# Altium schematic sheet JacdacKeycapButtonBc30 135.SchDoc: Complete design
size A4; DocumentNumber: 1; SheetNumber: 1; SheetTotal: 1; VersionControl_RevNumber: 1
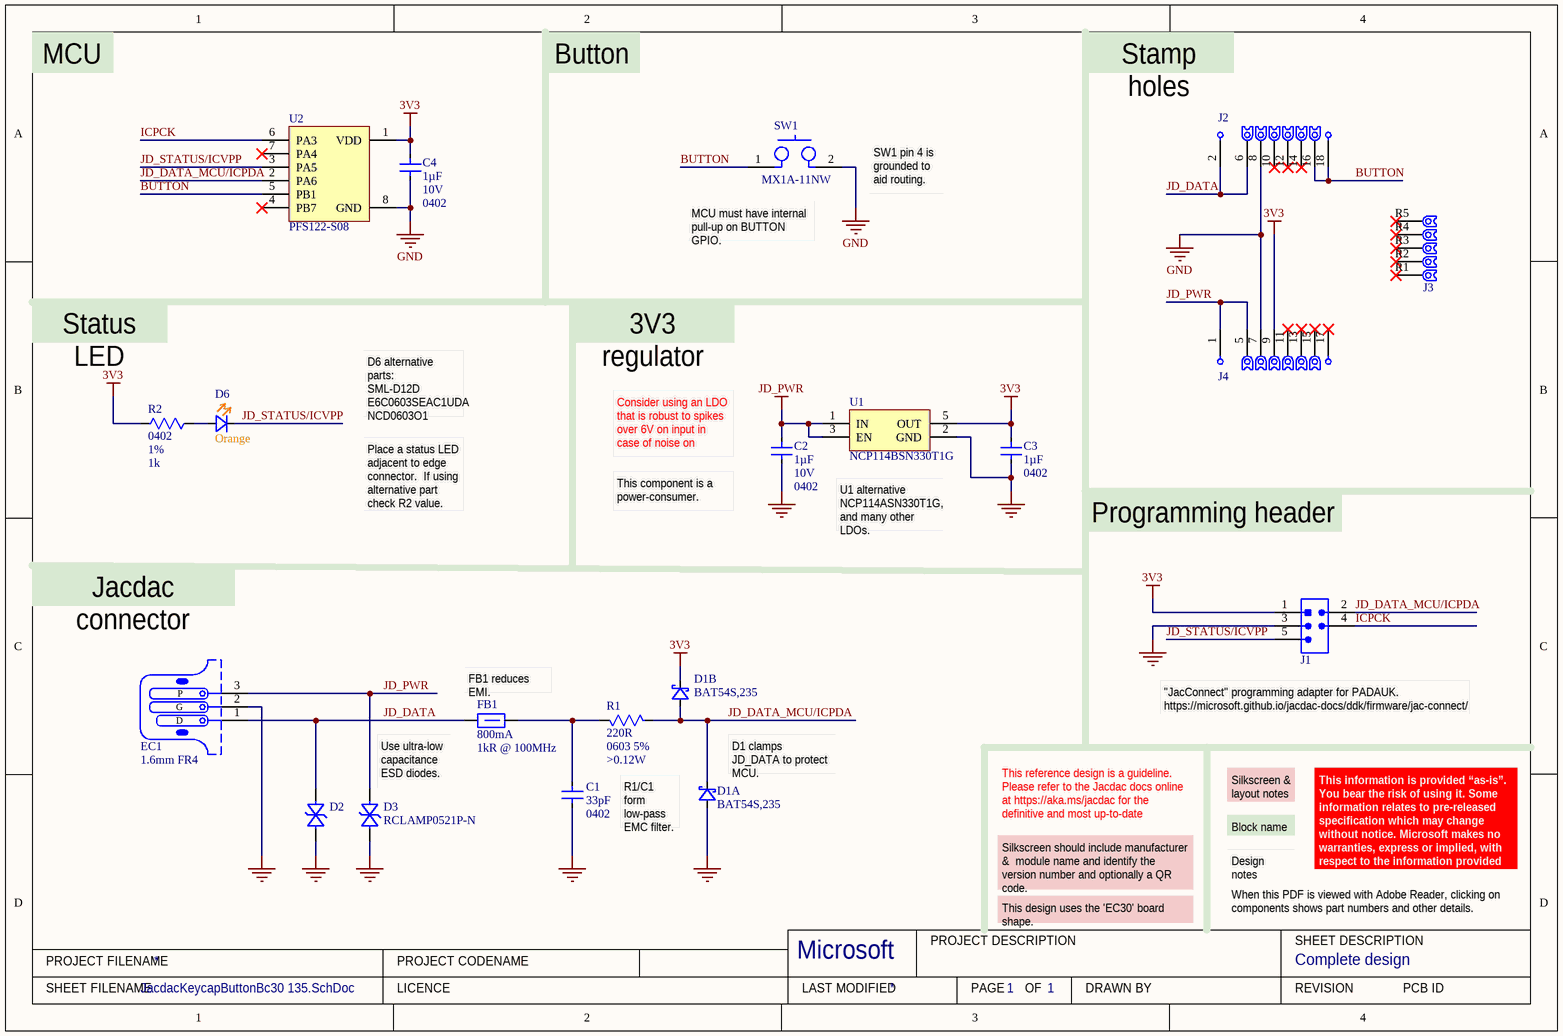
[diagram p0: JacdacKeycapButtonBc30 135.SchDoc]

## Parts
C1  Case Code (Imperial): 0402  Capacitance: 33pF  [C0402_0.55MM - without outline]  (hidden comment: CL05C330JB5NNNC)
C2  Capacitance: 1µF  Voltage Rating: 10V  Case Code (Imperial): 0402  [C0402_0.55MM - without outline]  (hidden comment: CL05A105KP5NNNC)
C3  Capacitance: 1µF  Case Code (Imperial): 0402  [C0402_0.55MM - without outline]  (hidden comment: CL05A105KP5NNNC)
C4  Capacitance: 1µF  Voltage Rating: 10V  Case Code (Imperial): 0402  [C0402_0.55MM - without outline]  (hidden comment: CL05A105KP5NNNC)
D1  Manufacturer Part Number: BAT54S,235  [NXP-BAT54S-TO-236AB - without outline]  (hidden comment: BAT54S)  (parts A,B of 2)
D2  RCLAMP0521P-N  [TVS 0402 - XL]  (value not drawn)
D3  RCLAMP0521P-N  [TVS 0402 - XL]
D6  Colour: Orange  [0603 Orange - without outline]  (hidden comment: 19-217/S2C-AQ1R1B/3T)
EC1  PCB Type: 1.6mm FR4  [JACDAC_EDGE_CONNECTOR_NO_TRACES_3D_PADS]  (hidden comment: 3 pin JACDAC edge connector)  (no BOM)
FB1  Current Rating: 800mA  Impedance: 1kR @ 100MHz  [TDK MPZ1608 0.8mm - without outline]  (hidden comment: TDK MPZ1608S102ATA00)
J1  Hack Connect Mini 1.27 mm pitch 2-row  [HACK_CONNECT_MINI_5_X_1_27_0.559mm_TH]  (value not drawn)  (no BOM)
J2  0.1"  [Jacdac BC30 stamp holes 20mm top x8]  (value not drawn)  (no BOM)
J3  BC30 stamp holes  [Jacdac BC30 stamp holes 10mm right x5]  (value not drawn)  (no BOM)
J4  0.1"  [Jacdac BC30 stamp holes 20mm bottom x8]  (value not drawn)  (no BOM)
R1  Case/Package: 0603  Comment 1: 5%  Comment 2: >0.12W  [RC0603]  (hidden comment: 220R)
R2  Case Code (Imperial): 0402  Tolerance: 1%  Resistance: 1k  [R0402 - Without outline]  (hidden comment: RC0402FR-071KL)
SW1  Mechanical keyboard mount  [MX1A-11NW]  (value not drawn)
U1  LDO 3.3V/300 mA  [ON_SEMI-SOT23-5 - without outline]  (value not drawn)
U2  PFS122-S08  [SOP-8]

## Nets
3V3: C3.2 C4.2 D1.2(K) J1.1(VCC) J4.9 R2.2 U1.5(OUT) U2.1(VDD)
GND: C1.1 C2.1 C3.1 C4.1 D1.1(A) D2.2(A) D3.2(A) EC1.2(G) J1.3(GND) J2.8 J4.7 SW1.2(B) U1.2(GND) U2.8(GND)
JD_PWR: C2.2 D3.1(K) EC1.3(P) J4.1 J4.5 U1.1(IN) U1.3(EN)
BUTTON: J2.16 J2.18 SW1.1(A) U2.5(PB1)
ICPCK: J1.4(SWCLK) U2.6(PA3)
JD_DATA: D2.1(K) EC1.1(D) FB1.1 J2.2 J2.6
JD_DATA_MCU/ICPDA: D1.3(K) J1.2(SWDIO) R1.1 U2.2(PA6)
JD_STATUS/ICVPP: D6.1(K) J1.5(RESET) U2.3(PA5)
NetC1_2: C1.2 FB1.2 R1.2
NetD6_2: D6.2(A) R2.1

Not connected (* = marked no-connect by the designer): J2 10* 12* 14*; J3 R1* R2* R3* R4* R5*; J4 11* 13* 15* 17*; U2 4(PB7)* 7(PA4)*

## Notes on the sheet
- MCU
- Button
- Stamp holes
- (near SW1) MCU must have internal pull-up on BUTTON GPIO.
- SW1 pin 4 is grounded to aid routing.
- Status LED
- 3V3 regulator
- D6 alternative parts:
  SML-D12D
  E6C0603SEAC1UDA
  NCD0603O1
- Place a status LED adjacent to edge connector.  If using alternative part check R2 value.
- (near C2) Consider using an LDO that is robust to spikes over 6V on input in case of noise on JD_PWR.
- (near C2) This component is a power-consumer.
- U1 alternative
  NCP114ASN330T1G, and many other LDOs.
- Programming header
- Jacdac connector
- (near FB1) FB1 reduces EMI.
- (near J1) "JacConnect" programming adapter for PADAUK.
  https://microsoft.github.io/jacdac-docs/ddk/firmware/jac-connect/
- (near D3) Use ultra-low capacitance ESD diodes.
- (near D1) D1 clamps JD_DATA to protect MCU.
- (near D1) R1/C1 form low-pass EMC filter.
- This reference design is a guideline. Please refer to the Jacdac docs online at https://aka.ms/jacdac for the definitive and most up-to-date information.
- Block name
- Silkscreen & layout notes
- This design uses the 'EC30' board shape.
- Silkscreen should include manufacturer &  module name and identify the version number and optionally a QR code.
- Design notes
- When this PDF is viewed with Adobe Reader, clicking on components shows part numbers and other details.
- This information is provided “as-is”. You bear the risk of using it. Some information relates to pre-released specification which may change without notice. Microsoft makes no warranties, express or implied, with respect to the information provided here.
- PROJECT FILENAME
- PROJECT CODENAME
- Microsoft
- PROJECT DESCRIPTION
- SHEET DESCRIPTION
- SHEET FILENAME
- LICENCE
- LAST MODIFIED
- PAGE
- OF
- DRAWN BY
- REVISION
- PCB ID

## Library data of the parts
C1 = CL05C330JB5NNNC: CAP CER 33PF 50V C0G/NP0 0402; Manufacturer: Samsung; Material: Ceramic; Tolerance: 5%; Dielectric: C0G; Temperature Coefficient: 300ppm/°C; Supplier 1: Digi-Key; Manufacturer Part Number: CL05C330JB5NNNC; RoHS: Yes; Category: Ceramic Capacitors; Stock 1: 5436088; Pricing 1: 1=0.10000, 10=0.02300, 50=0.01260, 100=0.01040, 500=0.00740, 1000=0.00582, 2500=0.00529, 5000=0.00487 (USD); Mount: Surface Mount; Case Code (Metric): 1005; Contact Plating: Tin; Min Operating Temperature: -55°C; Max Operating Temperature: 125°C; Package Quantity: 1; Packaging: Tape and Reel; Voltage: 50V; Voltage Rating (DC): 50V; Series: CL; Construction: Flat; Length: 1mm; Width: 0.02inch; Height: 0.5mm; Thickness: 0.022inch; Depth: 0.5mm; Radiation Hardening: No; Lead Free: Lead Free; RoHS Compliant: Yes; ComponentLink1URL: https://datasheet.ciiva.com/15195/getdatasheetpartid-355282-15195687.pdf; ComponentLink1Description: Online datasheet; Supplier 2: Newark; Stock 2: 45340; Pricing 2: 1=0.12500, 25=0.02900, 100=0.01300, 250=0.01100, 500=0.00900, 1000=0.00600 (USD); Supplier 3: Mouser; Stock 3: 8877; Pricing 3: 1=0.10000, 10=0.01400, 50=0.01400, 100=0.01100, 1000=0.00600, 10000=0.00400 (USD); Supplier 4: Farnell; Stock 4: 10934; Pricing 4: 150=0.01120, 500=0.00860, 2500=0.00640, 5000=0.00550 (GBP); Supplier Part Number 4: 3013373RL; Supplier Part Number 3: 187-CL05C330JB5NNNC; Supplier Part Number 2: 82AC9259; Supplier Part Number 1: 1276-1272-1-ND; Voltage Rating: 50V; Case/Package: 0402
C2-C4 = CL05A105KP5NNNC: CAP CER 1UF 10V X5R 0402; Manufacturer: Samsung; Material: Ceramic; Tolerance: 10%; Supplier 1: Digi-Key; Manufacturer Part Number: CL05A105KP5NNNC; RoHS: Yes; Category: Capacitors; Stock 1: 5705569; Pricing 1: 1=0.10000, 10=0.03900, 50=0.02100, 100=0.01720, 500=0.01228, 1000=0.00965, 2500=0.00877, 5000=0.00807 (USD); Mount: Surface Mount; Case/Package: 0402; Case Code (Metric): 1005; Contact Plating: Tin; Min Operating Temperature: -55°C; Max Operating Temperature: 85°C; Dielectric: X5R; Package Quantity: 1; Packaging: Tape and Reel; Length: 1mm; Height: 0.5mm; Width: 0.02inch; Thickness: 0.022inch; Depth: 0.5mm; Radiation Hardening: No; ComponentLink1URL: https://datasheet.ciiva.com/15195/getdatasheetpartid-358390-15195630.pdf; ComponentLink1Description: Online datasheet; Supplier 2: Mouser; Stock 2: 928941; Pricing 2: 1=0.10000, 10=0.04200, 100=0.01800, 500=0.01300, 1000=0.01000, 2500=0.00900 (USD); Supplier 3: Farnell; Stock 3: 53670; Pricing 3: 10=0.02450, 100=0.02000, 500=0.01310, 2500=0.00920, 5000=0.00810, 10000=0.00640, 50000=0.00490 (GBP); Supplier Part Number 3: 3013329; Supplier Part Number 2: 187-CL05A105KP5NNNC; Supplier Part Number 1: 1276-1076-1-ND; Created: DG; Checked: ?
  C3: Voltage Rating: 10V
D1 = BAT54S: DIODE ARRAY SCHOTTKY 30V SOT23; Manufacturer: Nexperia; Supplier 1: Digi-Key; RoHS: No; Category: Rectifier Diodes; Stock 1: 14011; Pricing 1: 1=0.13000, 10=0.11900, 100=0.05610, 500=0.03326, 1000=0.02185, 5000=0.02138 (USD); ComponentLink1URL: https://assets.nexperia.com/documents/data-sheet/BAT54_SER.pdf; ComponentLink1Description: NXP datasheet online; Supplier 2: Mouser; Supplier 3: RSComponents; Supplier Part Number 2: 771-BAT54S235; Supplier Part Number 3: 1707990; Supplier Part Number 1: 1727-1868-1-ND
D2 D3 = RCLAMP0521P-N: Bidirectional 5V (Max) 6V 16V 3.5A (8/20us) 0402 TVS RoHS; Manufacturer: Born Semiconductor; Package: 0402; Created By: D Gakure; Checked By: ?; Supplier1: LCSC; Supplier1 Part Number: C316043; ComponentLink1Description: Online datasheet; ComponentLink1URL: https://datasheet.lcsc.com/szlcsc/Bourne-Semicon-Shenzhen-RCLAMP0521P-N_C316043.pdf; Manufacturer Part Number: RCLAMP0521P-N
D6 = 19-217/S2C-AQ1R1B/3T: LED ORANGE DIFFUSED 1608 SMD; Manufacturer: Everlight Elec; Lens Color: White; Luminous Intensity: 100mcd; Test Current: 25mA; Dominant Wavelength: 605nm; Forward Voltage: 2.05V; Manufacturer Part Number: 19-217/S2C-AQ1R1B/3T; RoHS: Yes; Category: LEDs; Mount: Surface Mount; Case/Package: 0603; Color: Orange; Case Code (Metric): 1608; Case Code (Imperial): 0603; Lens Transparency: Diffused; Length: 1.6mm; Width: 0.8mm; Height: 0.65mm; Lead Free: Lead Free; ComponentLink1URL: https://datasheet.lcsc.com/lcsc/1912171731_Everlight-Elec-19-217-S2C-AQ1R1B-3T_C146215.pdf; ComponentLink1Description: Online datasheet; Supplier 1: LCSC; Supplier Part Number 1: C146215
EC1 = Jacdac edge connector: 3 pin Jacdac edge connector 1.27mm pitch; Manufacturer Part Number: JACDAC_EDGE_CONNECTOR; Checked By: ?; Created By: D. Gakure; ComponentLink1Description: Yuliang JACDAC cable connector drawing online; ComponentLink1URL: https://github.com/microsoft/jacdac-mdk/blob/main/connector/JACDAC-Connector-by-Yuliang-2020-11-28.pdf; ComponentLink2Description: JACDAC PCB edge connector spec onlin; ComponentLink2URL: https://github.com/microsoft/jacdac-mdk/blob/main/connector/JACDAC_PCB_Edge_Connector_Drawing_JD-PEC-01_rev_01.pdf
FB1 = TDK MPZ1608S102ATA00: 0603 1k@100MHz 0.8A chip; Core Material: Ferrite; Tolerance: 25%; DC Resistance (DCR): 300mR; Supplier 1: Digi-Key; Stock 1: 113542; Pricing 1: 1=0.1, 10=0.079, 25=0.0716, 50=0.0644, 100=0.0472, 250=0.03432, 500=0.03146, 1000=0.02717 (USD); Mount: Surface Mount; Case/Package: 0603; Case Code (Metric): 1608; Case Code (Imperial): 0603; Package Quantity: 4000; Packaging: Tape and Reel; Max DC Current: 800mA; Length: 0.063inch; Height: 0.037inch; Width: 0.031inch; ComponentLink2URL: https://www.mouser.co.uk/datasheet/2/400/eads_commercial_power_mpz1608_en-923650.pdf; ComponentLink2Description: datasheet online; Supplier 2: Mouser; ComponentLink3Description: datasheet; ComponentLink3URL: Y:\System\Altium\Libraries 2014\TDK\Datasheets\eads_commercial_power_mpz1608_en-923650.pdf; Supplier Part Number 1: 445-8694-1-ND; Supplier Part Number 2: 810-MPZ1608S102ATA00; Manufacturer: TDK; Manufacturer Part Number: MPZ1608S102ATA00
J1 = HACK_CONNECT_MINI
J2 = Jacdac BC30 stamp holes 20mm top: 2.54mm, 6/8 way; Manufacturer: Generic; Manufacturer Part Number: TBD
J3 = Jacdac BC30 stamp holes 10mm right: 2.54mm, 5 way; Manufacturer: Generic; Manufacturer Part Number: TBD
J4 = Jacdac BC30 stamp holes 20mm bottom: 2.54mm, 6/8 way; Manufacturer: Generic; Manufacturer Part Number: TBD
R1 = RC0603FR-07220RL: Res Thick Film 0603 220 Ohm 1% 0.1W(1/10W) ±100ppm/°C Pad SMD T/R; Max Power Dissipation: 100mW; Voltage Rating: 50V; Supplier 1: Digi-Key; Manufacturer: = Manufacturer 1; Manufacturer Part Number: = Manufacturer Part Number 1; RoHS: Yes; Category: Chip SMD Resistors; Stock 1: 1257522; Pricing 1: 1=0.10000, 10=0.02300, 100=0.00930, 1000=0.00417, 2500=0.00362 (USD); Number of Pins: 2; Case Code (Imperial): 0603; Case Code (Metric): 1608; Size Code: 0603; Min Operating Temperature: -55°C; Max Operating Temperature: 155°C; Packaging: Tape and Reel; Tolerance: 1%; Resistor Type: Thick Film; Number of Terminations: 2; Temperature Coefficient: 100ppm/°C; Series: RC; Power Rating: 100mW; Package Quantity: 1; Features: Moisture Resistant; Voltage Rating (DC): 50V; Termination: SMD/SMT; Construction: Rectangular; Length: 1.6mm; Width: 0.031inch; Height: 0.022inch; Depth: 0.8mm; RoHS Compliant: Yes; REACH SVHC: No SVHC; Military Standard: Not; Lead Free: Lead Free; Supplier 2: Farnell; Supplier 3: Mouser; Supplier 4: RSComponents; Supplier Part Number 1: 311-220HRCT-ND; Supplier Part Number 3: 603-RC0603FR-07220RL; Supplier Part Number 2: 2421863; Supplier Part Number 4: 1995497; Resistance Tolerance: 1%; Resistance: 220R; Manufacturer Part Number 1: ="Manufacturer Part Number"; Manufacturer 1: ="Manufacturer"; ComponentLink4Description: online datasheet; ComponentLink4URL: https://datasheet.ciiva.com/46395/443971-46395002.pdf
R2 = RC0402FR-071KL: RES SMD 1K OHM 1% 1/16W 0402; Manufacturer: Yageo; Temperature Coefficient: 100ppm/°C; Voltage Rating (DC): 50V; Power Rating: 62.5mW; Supplier 1: Digi-Key; Manufacturer Part Number: RC0402FR-071KL; RoHS: Yes; Category: Resistors; Stock 1: 37591306; Pricing 1: 1=0.10000, 10=0.01400, 100=0.00580, 1000=0.00262, 2500=0.00228, 5000=0.00188 (USD); Case/Package: 0402; Number of Pins: 2; Case Code (Metric): 1005; Min Operating Temperature: -55°C; Max Operating Temperature: 155°C; Resistor Type: Thick Film; Packaging: Tape and Reel; Voltage Rating: 50V; Termination: SMD/SMT; Length: 1mm; Height: 0.32mm; Width: 0.5mm; Depth: 0.5mm; REACH SVHC: Unknown; Lead Free: Lead Free; Military Standard: Not; ComponentLink2URL: https://datasheet.ciiva.com/12666/pyu-rc0402-51-rohs-l-6-r-12666741.pdf; ComponentLink2Description: Online datasheet; Supplier 2: Mouser; Stock 2: 11912978; Pricing 2: 1=0.10000, 10=0.01200, 100=0.00400, 1000=0.00400, 2500=0.00400, 10000=0.00300 (USD); Supplier 3: Farnell; Stock 3: 29900; Pricing 3: 1=0.08130, 25=0.01210, 100=0.01120, 250=0.01030, 500=0.00900 (GBP); Supplier Part Number 3: 2132441; Supplier Part Number 2: 603-RC0402FR-071KL; Supplier Part Number 1: 311-1.00KLRDKR-ND; Created: D.G; Checked: ?
SW1 = MX1A-11NW: Pushbutton Switch SPST-NO Keyswitch Through Hole; Manufacturer 1: Cherry; Number of Terminals/Pins: 2; Max Current Rating: 100mA; Throw Configuration: SPST; Contact Current Rating: 10mA; Operating Force: 0.58N; Voltage Rating (AC): 12V; Contact Resistance: 200mR; Electrical Life: 50000000Cycles; Illumination Type: Illuminated; Switch Function: Off-Mom; Insulation Resistance: 100MR; Actuator Type: PLUNGER; Row Spacing: 6.35mm; Actuator Length: 3.6mm; Supplier 1: Digi-Key; RoHS: Yes; Category: Pushbutton Switches; Stock 1: 55920; Pricing 1: 1=0.94000, 10=0.83800, 25=0.79520, 50=0.75640, 100=0.72110, 250=0.68932, 500=0.61862, 1000=0.58328 (USD); Mount: Through Hole,PCB; Case/Package: Module; Number of Pins: 2; Contact Material: Gold,Silver; Contact Plating: Gold; Housing Material: Thermoplastic; Min Operating Temperature: -10°C; Max Operating Temperature: 70°C; Voltage Rating (DC): 12V; Max Voltage Rating (AC): 12V; Max Voltage Rating (DC): 12V; Package Quantity: 1000; Current Rating: 10mA; Packaging: Bulk; Termination: PC Pin; Switching Current: 10mA; Orientation: Straight; Series: MX; Contact Type: 1 maker; Terminal Pitch: 2.54mm; REACH SVHC: Unknown; Lead Free: Lead Free; Flammability Rating: UL94 HB; RoHS Compliant: Yes; Supplier 2: Farnell; Supplier 3: Mouser; Supplier Part Number 3: 540-MX1A-11NW; Supplier Part Number 1: CH160-ND; Supplier Part Number 2: 2292961; ComponentLink1Description: datasheet (offline); ComponentLink1URL: Y:\System\Altium\Libraries 2014\Cherry\Datasheets\MX1A-11NW.pdf; ComponentLink2Description: datasheet (online); ComponentLink2URL: http://www.farnell.com/datasheets/2775479.pdf; Manufacturer Part Number 1: MX1A-11NW
U1 = NCP114BSN330T1G: CMOS Low Dropout Regulator (LDO), 300 mA 3.3V, Non-Active Discharge, TSOP5; Manufacturer: ON Semiconductor; Polarity: Positive; Quiescent Current: 50uA; Max Input Voltage: 5.5V; Min Input Voltage: 1.7V; Max Output Current: 300mA; Number of Outputs: 1; Accuracy: 2%; Output Type: Fixed; Supplier 1: Digi-Key; RoHS: Yes; Category: Voltage Regulators - Linear; Stock 1: 4067; Pricing 1: 1=0.45000, 10=0.33700, 25=0.29440, 100=0.19060, 250=0.15780, 500=0.12624, 1000=0.09679 (USD); Mount: Surface Mount; Case/Package: TSOP; Number of Pins: 5; Min Operating Temperature: -40°C; Max Operating Temperature: 85°C; Output Voltage: 3.3V; Lead Free: Lead Free; RoHS Compliant: Yes; ComponentLink1URL: http://www.farnell.com/datasheets/2118270.pdf?src-supplier=Farnell; ComponentLink1Description: Datasheet (online); Supplier 2: Mouser; Supplier 3: RSComponents; Supplier Part Number 2: 863-NCP114BSN330T1G; Supplier Part Number 3: 1263179; Supplier Part Number 1: NCP114BSN330T1GOSCT-ND; Manufacturer Part Number: NCP114BSN330T1G
U2 = PFS122-SO8: 8bit MTP MCU with 12-bit ADC; Manufacturer: PADAUK; ComponentLink1Description: Online datasheet; ComponentLink1URL: http://www.padauk.com.tw/upload/doc/PFS122%20datasheet_EN_V001_20220518.pdf; Package: SOP-8; Manufacturer Part Number: PFS122-S08